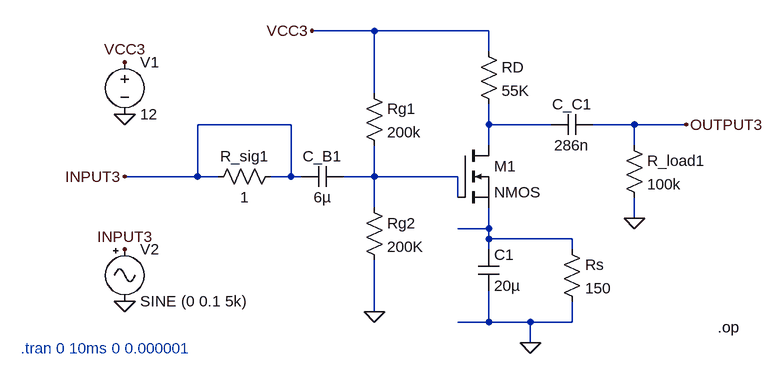
[diagram p0: schematic classicMOSFETinSpice.asc]
classicMOSFETinSpice.asc, the LTspice schematic file:
Version 4
SHEET 1 1424 680
WIRE -416 16 -512 16
WIRE -240 16 -416 16
WIRE -240 48 -240 16
WIRE -416 112 -416 16
WIRE -544 160 -688 160
WIRE -240 160 -240 128
WIRE -144 160 -240 160
WIRE -16 160 -80 160
WIRE 64 160 -16 160
WIRE -240 192 -240 160
WIRE -16 192 -16 160
WIRE -688 240 -688 160
WIRE -688 240 -800 240
WIRE -656 240 -688 240
WIRE -544 240 -544 160
WIRE -544 240 -576 240
WIRE -528 240 -544 240
WIRE -416 240 -416 192
WIRE -416 240 -464 240
WIRE -288 240 -416 240
WIRE -288 272 -288 240
WIRE -416 288 -416 240
WIRE -16 304 -16 272
WIRE -240 320 -240 288
WIRE -240 320 -288 320
WIRE -240 336 -240 320
WIRE -112 336 -240 336
WIRE -240 352 -240 336
WIRE -112 352 -112 336
WIRE -416 448 -416 368
WIRE -240 464 -240 416
WIRE -240 464 -288 464
WIRE -176 464 -240 464
WIRE -112 464 -112 432
WIRE -112 464 -176 464
WIRE -176 496 -176 464
FLAG -16 304 0
FLAG -416 448 0
FLAG -176 496 0
FLAG -800 240 INPUT3
FLAG -800 352 INPUT3
FLAG -512 16 VCC3
FLAG -800 64 VCC3
FLAG 64 160 OUTPUT3
FLAG -800 432 0
FLAG -800 144 0
SYMBOL res -432 272 R0
SYMATTR InstName Rg2
SYMATTR Value 200K
SYMBOL res -432 96 R0
SYMATTR InstName Rg1
SYMATTR Value 200k
SYMBOL res -256 32 R0
SYMATTR InstName RD
SYMATTR Value 55K
SYMBOL res -32 176 R0
SYMATTR InstName R_load1
SYMATTR Value 100k
SYMBOL res -560 224 R90
WINDOW 0 0 56 VBottom 2
WINDOW 3 32 56 VTop 2
SYMATTR InstName R_sig1
SYMATTR Value 1
SYMBOL cap -464 224 R90
WINDOW 0 0 32 VBottom 2
WINDOW 3 32 32 VTop 2
SYMATTR InstName C_B1
SYMATTR Value 6µ
SYMBOL cap -80 144 R90
WINDOW 0 0 32 VBottom 2
WINDOW 3 32 32 VTop 2
SYMATTR InstName C_C1
SYMATTR Value 286n
SYMBOL voltage -800 48 R0
SYMATTR InstName V1
SYMATTR Value 12
SYMBOL Misc\\signal -800 336 R0
SYMATTR InstName V2
SYMATTR Value SINE (0 0.1 5k)
SYMBOL res -128 336 R0
SYMATTR InstName Rs
SYMATTR Value 150
SYMBOL cap -256 352 R0
SYMATTR InstName C1
SYMATTR Value 20µ
SYMBOL nmos -288 192 R0
SYMATTR InstName M1
TEXT -960 504 Left 2 ;.tran 0 10ms 0 0.000001
TEXT 112 472 Left 2 !.op

The netlist it stands for:
* classicMOSFETinSpice.asc
Rg2 N002 0 200K
Rg1 VCC3 N002 200k
RD VCC3 N001 55K
R_load1 OUTPUT3 0 100k
R_sig1 INPUT3 INPUT3 1
C_B1 N002 INPUT3 6µ
C_C1 OUTPUT3 N001 286n
V1 VCC3 0 12
V2 INPUT3 0 SINE (0 0.1 5k)
Rs N003 0 150
C1 N003 0 20µ
M1 N001 N002 N003 N003 NMOS
.model NMOS NMOS
.model PMOS PMOS
.lib standard.mos
* .tran 0 10ms 0 0.000001
.op
.backanno
.end